# EasyEDA Pro project board-a24-color.eprj

# Schematic sample_board
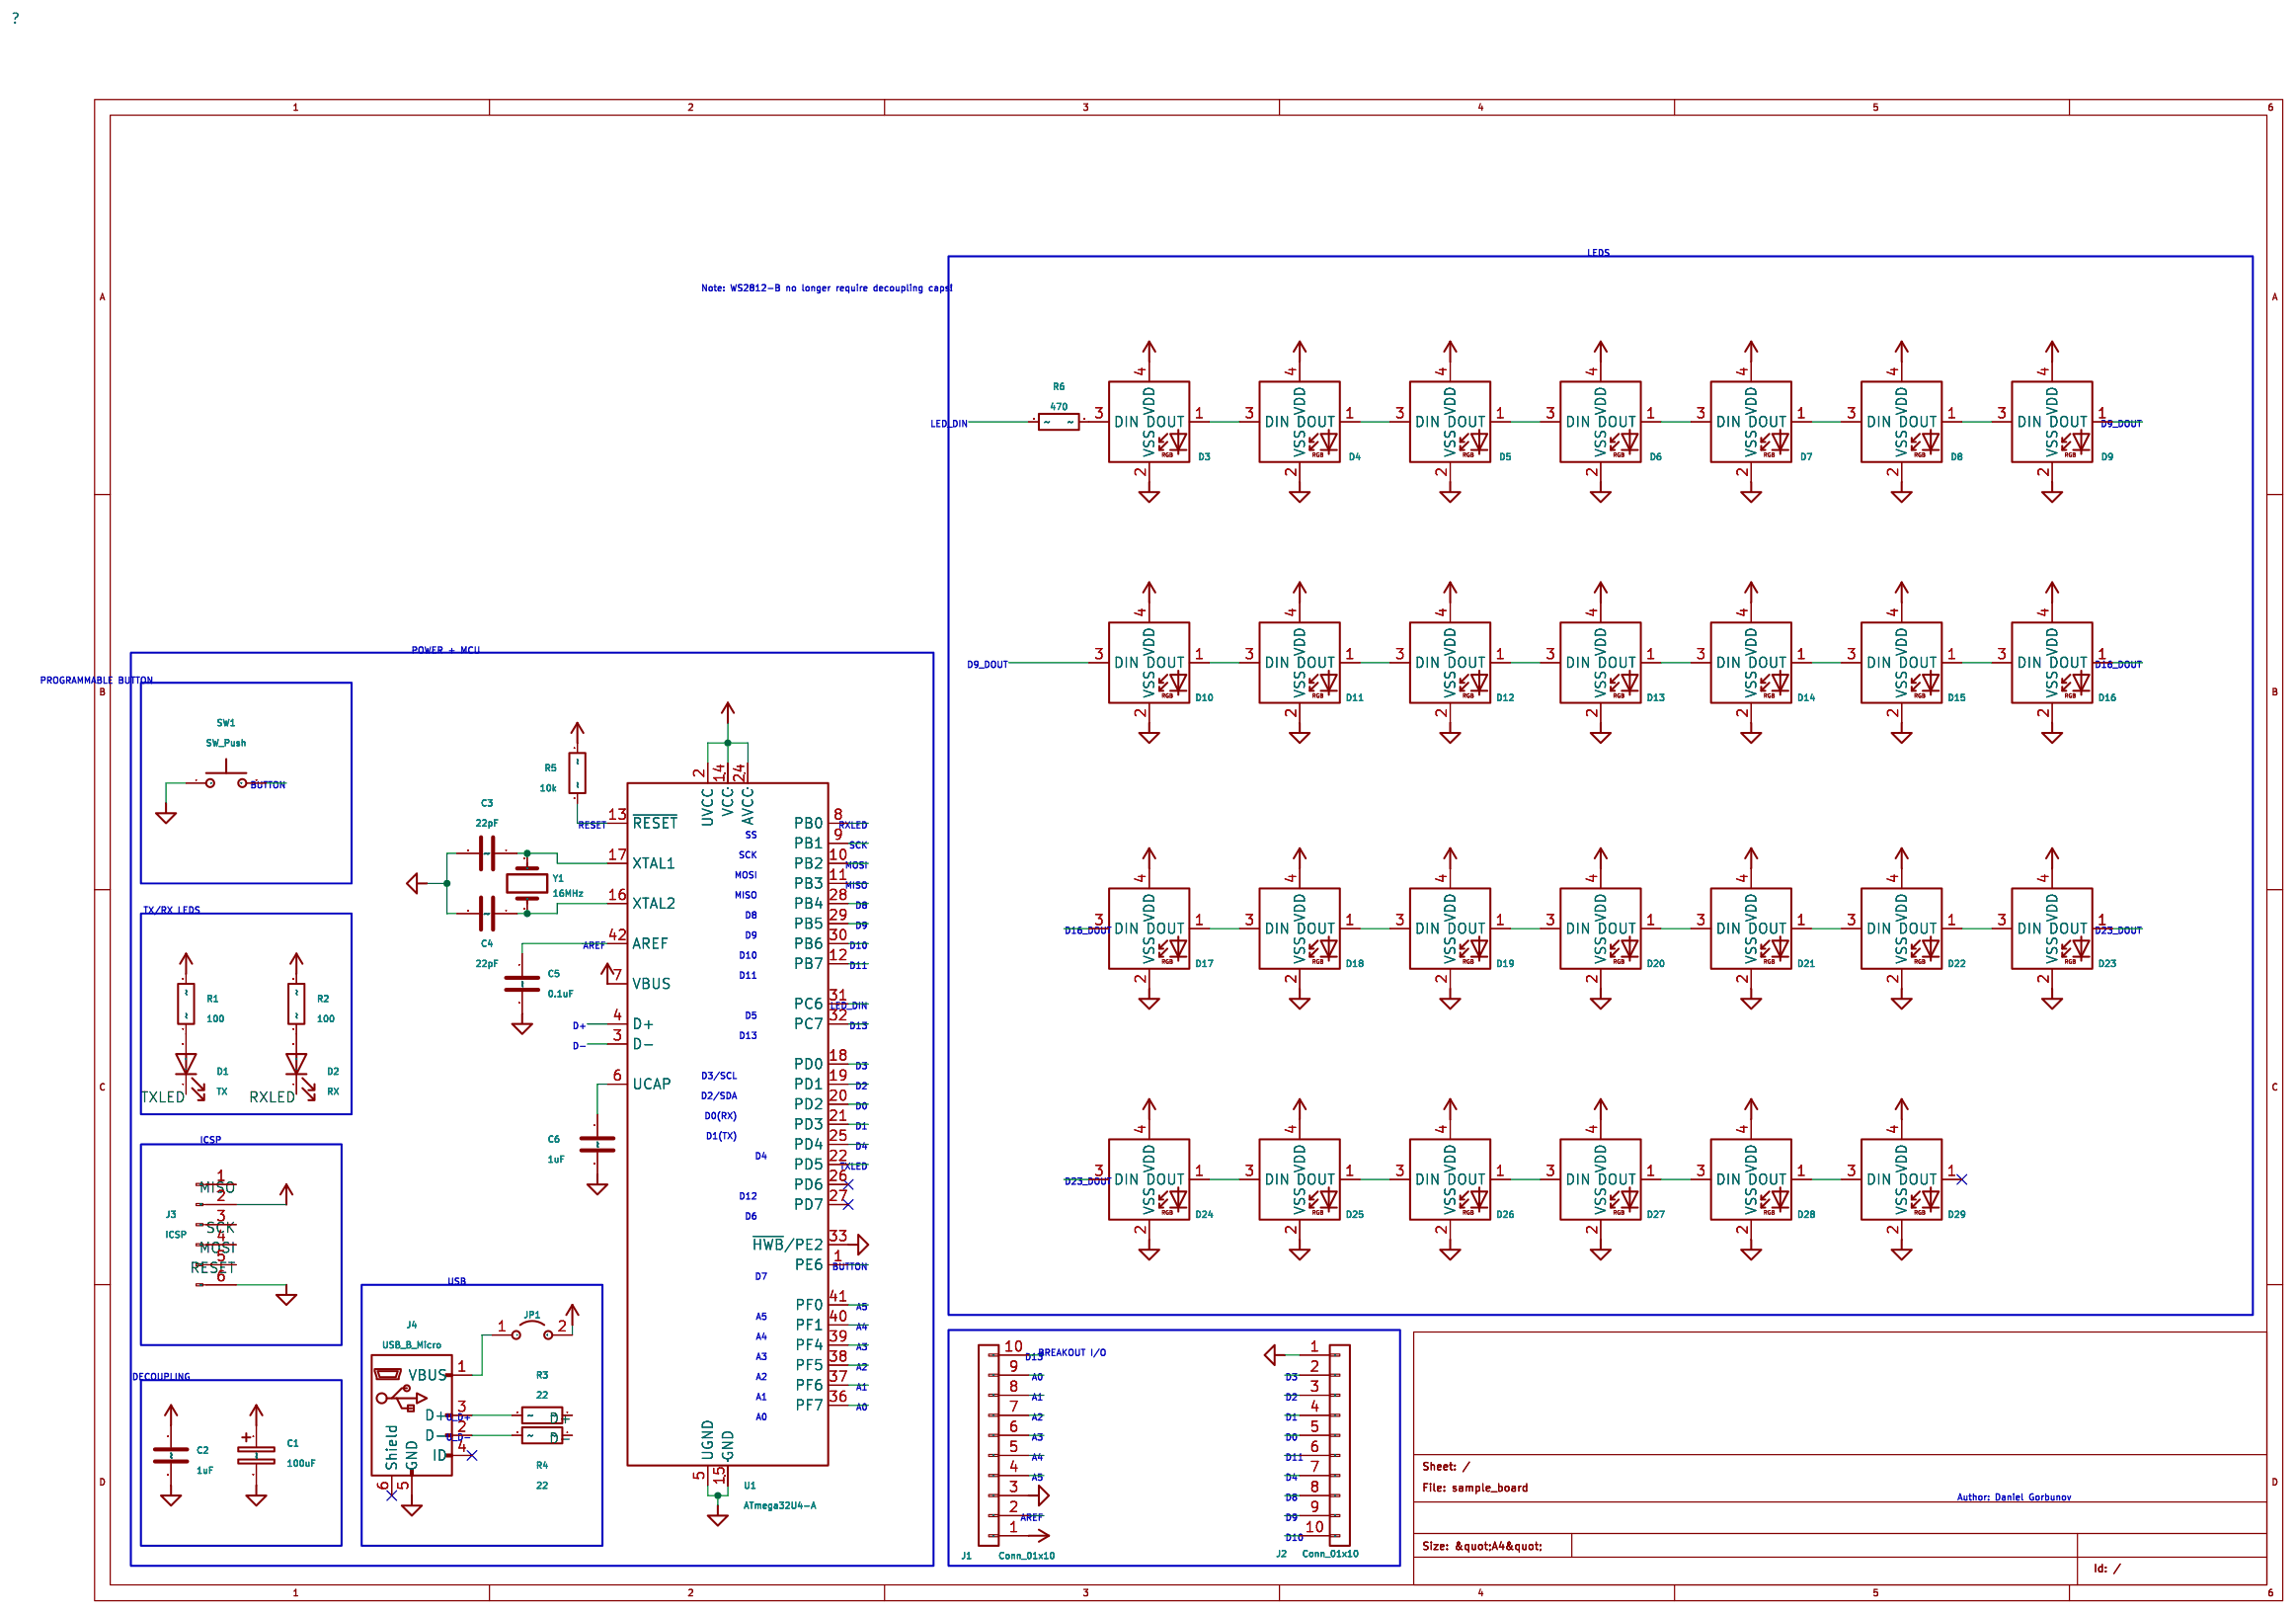
[diagram p0: schematic sheet]

## Parts
C1  100uF  [Capacitor_SMD:CP_Elec_5x5.3]
C2  1uF  [Capacitor_SMD:C_0805_2012Metric_Pad1.18x1.45mm_HandSolder]
C3  22pF  [Capacitor_SMD:C_0805_2012Metric_Pad1.18x1.45mm_HandSolder]
C4  22pF  [Capacitor_SMD:C_0805_2012Metric_Pad1.18x1.45mm_HandSolder]
C5  0.1uF  [Capacitor_SMD:C_0805_2012Metric_Pad1.18x1.45mm_HandSolder]
C6  1uF  [Capacitor_SMD:C_0805_2012Metric_Pad1.18x1.45mm_HandSolder]
D1  TX  [LED_SMD:LED_0805_2012Metric_Pad1.15x1.40mm_HandSolder]
D2  RX  [LED_SMD:LED_0805_2012Metric_Pad1.15x1.40mm_HandSolder]
D3  SK6812MINI  [LED_SMD:LED_SK6812MINI_PLCC4_3.5x3.5mm_P1.75mm]
D4  SK6812MINI  [LED_SMD:LED_SK6812MINI_PLCC4_3.5x3.5mm_P1.75mm]
D5  SK6812MINI  [LED_SMD:LED_SK6812MINI_PLCC4_3.5x3.5mm_P1.75mm]
D6  SK6812MINI  [LED_SMD:LED_SK6812MINI_PLCC4_3.5x3.5mm_P1.75mm]
D7  SK6812MINI  [LED_SMD:LED_SK6812MINI_PLCC4_3.5x3.5mm_P1.75mm]
D8  SK6812MINI  [LED_SMD:LED_SK6812MINI_PLCC4_3.5x3.5mm_P1.75mm]
D9  SK6812MINI  [LED_SMD:LED_SK6812MINI_PLCC4_3.5x3.5mm_P1.75mm]
D10  SK6812MINI  [LED_SMD:LED_SK6812MINI_PLCC4_3.5x3.5mm_P1.75mm]
D11  SK6812MINI  [LED_SMD:LED_SK6812MINI_PLCC4_3.5x3.5mm_P1.75mm]
D12  SK6812MINI  [LED_SMD:LED_SK6812MINI_PLCC4_3.5x3.5mm_P1.75mm]
D13  SK6812MINI  [LED_SMD:LED_SK6812MINI_PLCC4_3.5x3.5mm_P1.75mm]
D14  SK6812MINI  [LED_SMD:LED_SK6812MINI_PLCC4_3.5x3.5mm_P1.75mm]
D15  SK6812MINI  [LED_SMD:LED_SK6812MINI_PLCC4_3.5x3.5mm_P1.75mm]
D16  SK6812MINI  [LED_SMD:LED_SK6812MINI_PLCC4_3.5x3.5mm_P1.75mm]
D17  SK6812MINI  [LED_SMD:LED_SK6812MINI_PLCC4_3.5x3.5mm_P1.75mm]
D18  SK6812MINI  [LED_SMD:LED_SK6812MINI_PLCC4_3.5x3.5mm_P1.75mm]
D19  SK6812MINI  [LED_SMD:LED_SK6812MINI_PLCC4_3.5x3.5mm_P1.75mm]
D20  SK6812MINI  [LED_SMD:LED_SK6812MINI_PLCC4_3.5x3.5mm_P1.75mm]
D21  SK6812MINI  [LED_SMD:LED_SK6812MINI_PLCC4_3.5x3.5mm_P1.75mm]
D22  SK6812MINI  [LED_SMD:LED_SK6812MINI_PLCC4_3.5x3.5mm_P1.75mm]
D23  SK6812MINI  [LED_SMD:LED_SK6812MINI_PLCC4_3.5x3.5mm_P1.75mm]
D24  SK6812MINI  [LED_SMD:LED_SK6812MINI_PLCC4_3.5x3.5mm_P1.75mm]
D25  SK6812MINI  [LED_SMD:LED_SK6812MINI_PLCC4_3.5x3.5mm_P1.75mm]
D26  SK6812MINI  [LED_SMD:LED_SK6812MINI_PLCC4_3.5x3.5mm_P1.75mm]
D27  SK6812MINI  [LED_SMD:LED_SK6812MINI_PLCC4_3.5x3.5mm_P1.75mm]
D28  SK6812MINI  [LED_SMD:LED_SK6812MINI_PLCC4_3.5x3.5mm_P1.75mm]
D29  SK6812MINI  [LED_SMD:LED_SK6812MINI_PLCC4_3.5x3.5mm_P1.75mm]
J1  Conn_01x10  [Connector_PinHeader_2.54mm:PinHeader_1x10_P2.54mm_Vertical]
J2  Conn_01x10  [Connector_PinHeader_2.54mm:PinHeader_1x10_P2.54mm_Vertical]
J3  ICSP  [Connector_PinHeader_2.54mm:PinHeader_2x03_P2.54mm_Vertical]
J4  USB_B_Micro  [Connector_USB:USB_Micro-B_GCT_USB3076-30-A]
JP1  Jumper_2_Open  [Jumper:SolderJumper-2_P1.3mm_Open_TrianglePad1.0x1.5mm]
R1  100  [Resistor_SMD:R_0805_2012Metric_Pad1.20x1.40mm_HandSolder]
R2  100  [Resistor_SMD:R_0805_2012Metric_Pad1.20x1.40mm_HandSolder]
R3  22  [Resistor_SMD:R_0805_2012Metric_Pad1.20x1.40mm_HandSolder]
R4  22  [Resistor_SMD:R_0805_2012Metric_Pad1.20x1.40mm_HandSolder]
R5  10k  [Resistor_SMD:R_0805_2012Metric_Pad1.20x1.40mm_HandSolder]
R6  470  [Resistor_SMD:R_0805_2012Metric_Pad1.20x1.40mm_HandSolder]
SW1  SW_Push  [Button_Switch_SMD:SW_SPST_PTS647_Sx38]
U1  ATmega32U4-A  [Package_QFP:TQFP-44_10x10mm_P0.8mm]
Y1  16MHz  [Crystal:Crystal_SMD_5032-2Pin_5.0x3.2mm]

## Library data of the parts
C1 = Device_C_Polarized
C2-C6 = Device_C
D1 D2 = Device_LED
D3-D29 = LED_SK6812MINI: User doc link: https://cdn-shop.adafruit.com/product-files/2686/SK6812MINI_REV.01-1-2.pdf
J1 J2 = Connector_Generic_Conn_01x10
J3 = Connector_Conn_01x06_Pin
J4 = Connector_USB_B_Micro
JP1 = Jumper_Jumper_2_Open
R1-R6 = Device_R
SW1 = Switch_SW_Push: Push button switch, generic, two pins
U1 = MCU_Microchip_ATmega_ATmega32U4-A: User doc link: http://ww1.microchip.com/downloads/en/DeviceDoc/Atmel-7766-8-bit-AVR-ATmega16U4-32U4_Datasheet.pdf
Y1 = Device_Crystal

## Nets
A0: J1.9(Pin) U1.36(PF7)
A1: J1.8(Pin) U1.37(PF6)
A2: J1.7(Pin) U1.38(PF5)
A3: J1.6(Pin) U1.39(PF4)
A4: J1.5(Pin) U1.40(PF1)
A5: J1.4(Pin) U1.41(PF0)
AREF: C5.1 J1.2(Pin) U1.42(AREF)
BUTTON: SW1.2 U1.1(PE6)
D0: J2.5(Pin) U1.20(PD2)
D1: J2.4(Pin) U1.21(PD3)
D2: J2.3(Pin) U1.19(PD1)
D3: J2.2(Pin) U1.18(PD0)
D4: J2.7(Pin) U1.25(PD4)
D8: J2.8(Pin) U1.28(PB4)
D9: J2.9(Pin) U1.29(PB5)
D9_DOUT: D9.1(DOUT) D10.3(DIN)
D10: J2.10(Pin) U1.30(PB6)
D11: J2.6(Pin) U1.12(PB7)
D13: J1.10(Pin) U1.32(PC7)
D16_DOUT: D16.1(DOUT) D17.3(DIN)
D23_DOUT: D23.1(DOUT) D24.3(DIN)
D+: R3.1 U1.4(D+)
D-: R4.1 U1.3(D-)
LED_DIN: R6.1 U1.31(PC6)
MISO: J3.1(Pin) U1.11(PB3)
MOSI: J3.4(Pin) U1.10(PB2)
POWER_+5V: C1.1 C2.1 D3.4(VDD) D4.4(VDD) D5.4(VDD) D6.4(VDD) D7.4(VDD) D8.4(VDD) D9.4(VDD) D10.4(VDD) D11.4(VDD) D12.4(VDD) D13.4(VDD) D14.4(VDD) D15.4(VDD) D16.4(VDD) D17.4(VDD) D18.4(VDD) D19.4(VDD) D20.4(VDD) D21.4(VDD) D22.4(VDD) D23.4(VDD) D24.4(VDD) D25.4(VDD) D26.4(VDD) D27.4(VDD) D28.4(VDD) D29.4(VDD) J1.1(Pin) J3.2(Pin) JP1.2(B) R1.2 R2.2 R5.1 U1.2(UVCC) U1.7(VBUS) U1.14(VCC) U1.24(AVCC) U1.34(VCC) U1.44(AVCC)
POWER_GND: C1.2 C2.2 C3.2 C4.2 C5.2 C6.2 D3.2(VSS) D4.2(VSS) D5.2(VSS) D6.2(VSS) D7.2(VSS) D8.2(VSS) D9.2(VSS) D10.2(VSS) D11.2(VSS) D12.2(VSS) D13.2(VSS) D14.2(VSS) D15.2(VSS) D16.2(VSS) D17.2(VSS) D18.2(VSS) D19.2(VSS) D20.2(VSS) D21.2(VSS) D22.2(VSS) D23.2(VSS) D24.2(VSS) D25.2(VSS) D26.2(VSS) D27.2(VSS) D28.2(VSS) D29.2(VSS) J1.3(Pin) J2.1(Pin) J3.6(Pin) J4.5(GND) SW1.1 U1.5(UGND) U1.15(GND) U1.23(GND) U1.33(~{HWB}/PE2) U1.35(GND) U1.43(GND)
RESET: J3.5(Pin) R5.2 U1.13(~{RESET})
RXLED: D2.1(K) U1.8(PB0)
SCK: J3.3(Pin) U1.9(PB1)
TXLED: D1.1(K) U1.22(PD5)
U_D+: J4.3(D+) R3.2
U_D-: J4.2(D-) R4.2
NET-(D1-A): D1.2(A) R1.1
NET-(D2-A): D2.2(A) R2.1
NET-(D3-DIN): D3.3(DIN) R6.2
NET-(D3-DOUT): D3.1(DOUT) D4.3(DIN)
NET-(D4-DOUT): D4.1(DOUT) D5.3(DIN)
NET-(D5-DOUT): D5.1(DOUT) D6.3(DIN)
NET-(D6-DOUT): D6.1(DOUT) D7.3(DIN)
NET-(D7-DOUT): D7.1(DOUT) D8.3(DIN)
NET-(D8-DOUT): D8.1(DOUT) D9.3(DIN)
NET-(D10-DOUT): D10.1(DOUT) D11.3(DIN)
NET-(D11-DOUT): D11.1(DOUT) D12.3(DIN)
NET-(D12-DOUT): D12.1(DOUT) D13.3(DIN)
NET-(D13-DOUT): D13.1(DOUT) D14.3(DIN)
NET-(D14-DOUT): D14.1(DOUT) D15.3(DIN)
NET-(D15-DOUT): D15.1(DOUT) D16.3(DIN)
NET-(D17-DOUT): D17.1(DOUT) D18.3(DIN)
NET-(D18-DOUT): D18.1(DOUT) D19.3(DIN)
NET-(D19-DOUT): D19.1(DOUT) D20.3(DIN)
NET-(D20-DOUT): D20.1(DOUT) D21.3(DIN)
NET-(D21-DOUT): D21.1(DOUT) D22.3(DIN)
NET-(D22-DOUT): D22.1(DOUT) D23.3(DIN)
NET-(D24-DOUT): D24.1(DOUT) D25.3(DIN)
NET-(D25-DOUT): D25.1(DOUT) D26.3(DIN)
NET-(D26-DOUT): D26.1(DOUT) D27.3(DIN)
NET-(D27-DOUT): D27.1(DOUT) D28.3(DIN)
NET-(D28-DOUT): D28.1(DOUT) D29.3(DIN)
NET-(J4-VBUS): J4.1(VBUS) JP1.1(A)
NET-(U1-UCAP): C6.1 U1.6(UCAP)
NET-(U1-XTAL1): C3.1 U1.17(XTAL1) Y1.1
NET-(U1-XTAL2): C4.1 U1.16(XTAL2) Y1.2

Not connected (* = marked no-connect by the designer): D29 1(DOUT)*; J4 4(ID)* 6(Shield)*; U1 26(PD6)* 27(PD7)*

## Notes on the sheet
- LEDS
- Note: WS2812-B no longer require decoupling caps!
- POWER + MCU
- PROGRAMMABLE BUTTON
- SS
- SCK
- MISO
- MOSI
- TX/RX LEDS
- D8
- D9
- D10
- D11
- D13
- D5
- D3/SCL
- D2/SDA
- D0(RX)
- ICSP
- D1(TX)
- D4
- D12
- D6
- USB
- D7
- A5
- A4
- A3
- BREAKOUT I/O
- DECOUPLING
- A2
- A0
- A1
- Author: Daniel Gorbunov

# Board sample_board
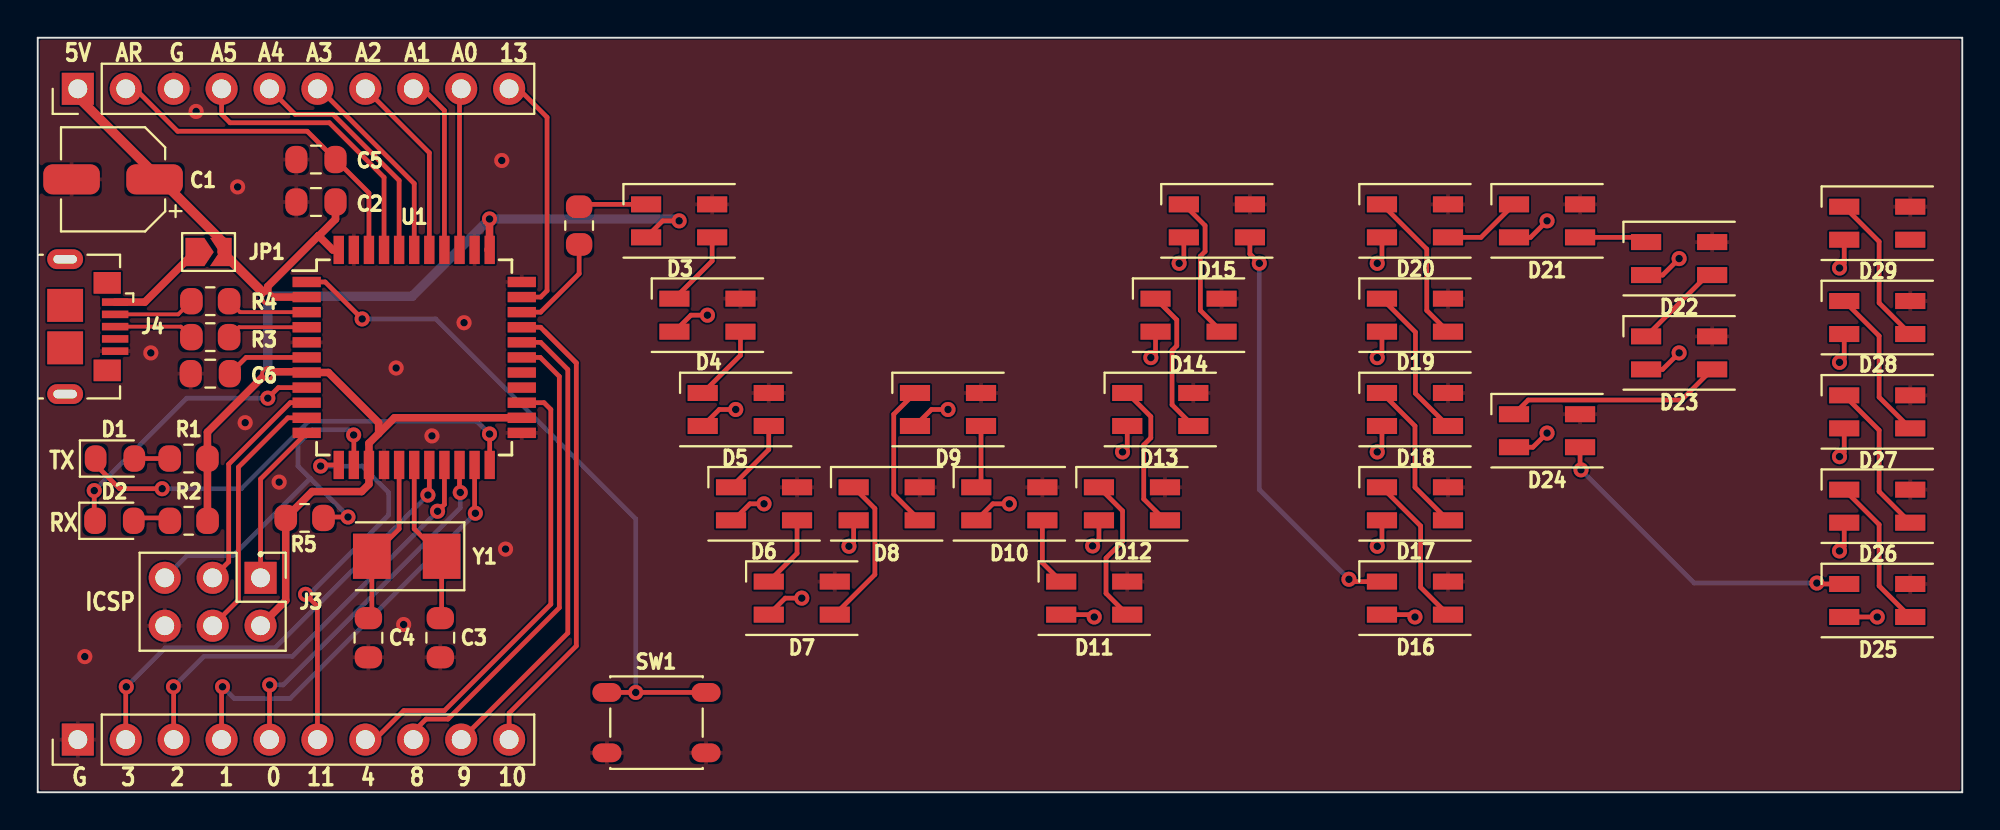
[diagram p1: board, top side]
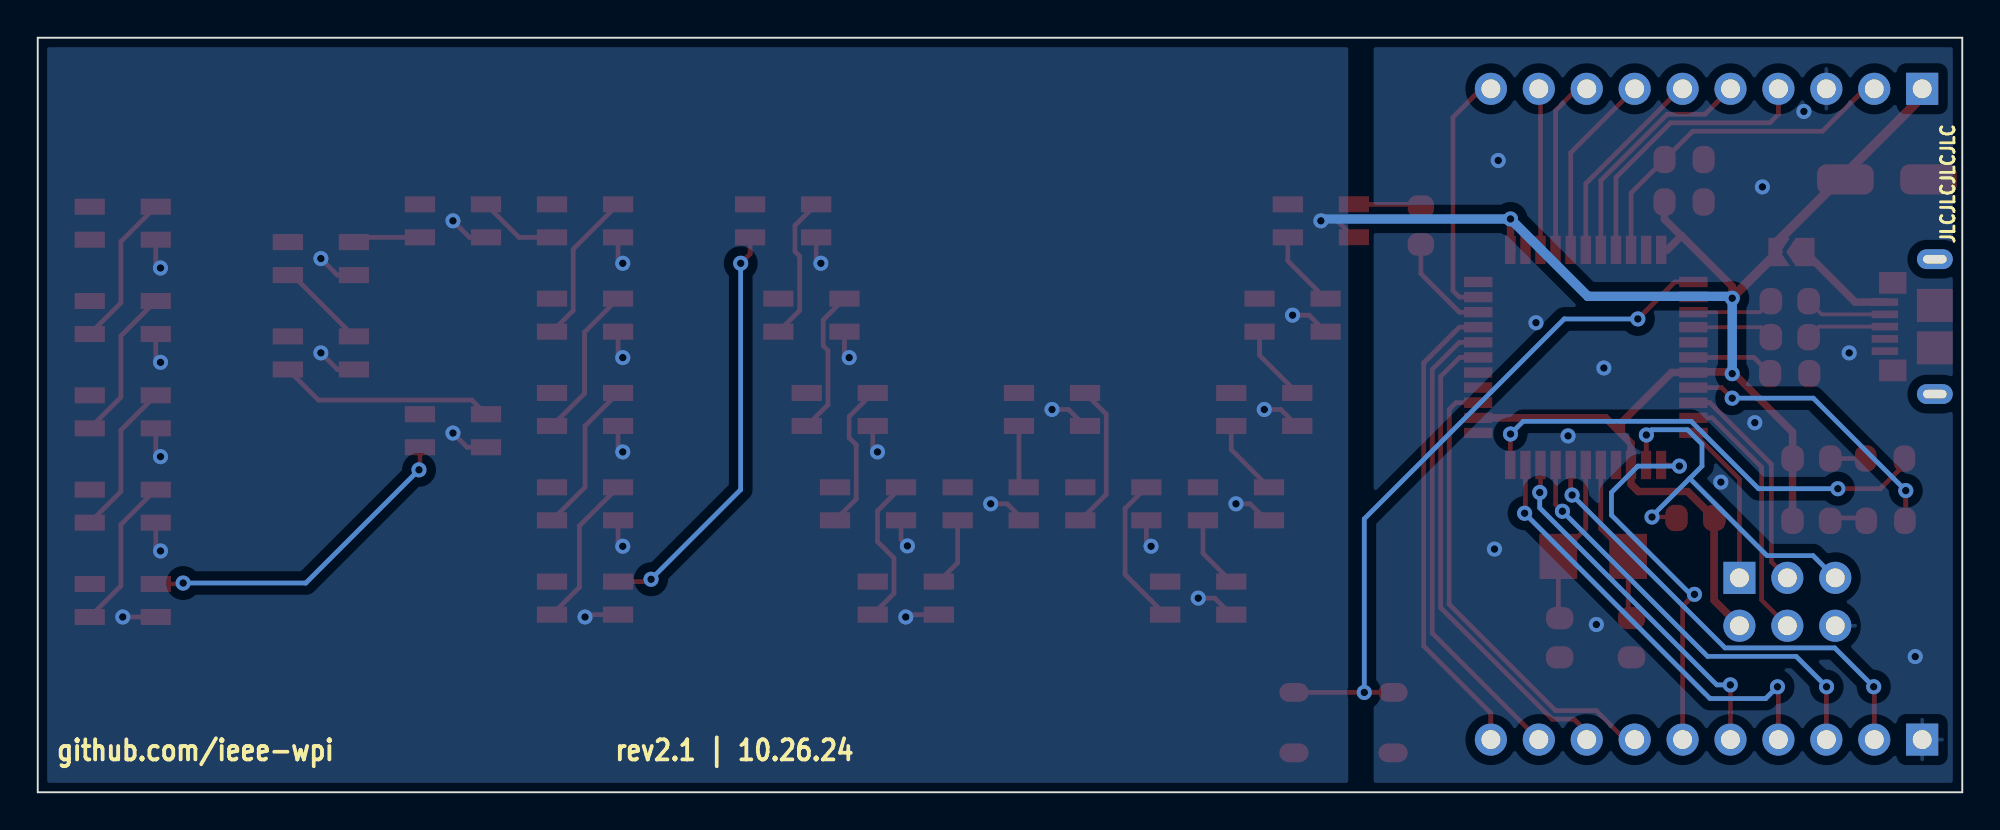
[diagram p2: board, bottom side, seen from below]

Outline 102 x 40 mm; copper layers: Top Layer, Bottom Layer. Coordinates in mm from the lower left corner of the outline.
Outline path: 0,40 102,40 102,0 0,0 0,40
Stack: Top Layer 0.0009mm / dielectric 1 0.0384mm FR4 er 4.5 / Bottom Layer 0.0009mm

## Design rules (mm)
spacing safeClearance (default): track to track 0.127, other pairs 0.127 to 0.2
track width trackWidth (default): min 0.127, default 0.254, max 2.54
differential pair differentialPair (default): width min 0.127, default 0.254, max 2.54; gap min 0.152, default 0.152
via viaSize (default): diameter min 0.5, default 0.61, max 10; hole min 0.3, default 0.305, max 6
net +5V uses CopperRegion1
pour ie950 uses CopperRegion2
pour ie951 uses CopperRegion1

## Placement (name value [footprint] x y rotation side)
C1  100uF  [Capacitor_SMD:CP_Elec_5x5.3]  3.99 32.49 180 top
C2  1uF  [Capacitor_SMD:C_0805_2012Metric_Pad1.18x1.45mm_HandSolder]  14.74 31.29 180 top
C3  22pF  [Capacitor_SMD:C_0805_2012Metric_Pad1.18x1.45mm_HandSolder]  21.34 8.19 270 top
C4  22pF  [Capacitor_SMD:C_0805_2012Metric_Pad1.18x1.45mm_HandSolder]  17.53 8.19 270 top
C5  0.1uF  [Capacitor_SMD:C_0805_2012Metric_Pad1.18x1.45mm_HandSolder]  14.74 33.54 180 top
C6  1uF  [Capacitor_SMD:C_0805_2012Metric_Pad1.18x1.45mm_HandSolder]  9.14 22.19 180 top
D1  TX  [LED_SMD:LED_0805_2012Metric_Pad1.15x1.40mm_HandSolder]  4.09 17.69 0 top
D2  RX  [LED_SMD:LED_0805_2012Metric_Pad1.15x1.40mm_HandSolder]  4.06 14.39 0 top
D3  SK6812MINI  [LED_SMD:LED_SK6812MINI_PLCC4_3.5x3.5mm_P1.75mm]  33.99 30.29 180 top
D4  SK6812MINI  [LED_SMD:LED_SK6812MINI_PLCC4_3.5x3.5mm_P1.75mm]  35.49 25.29 180 top
D5  SK6812MINI  [LED_SMD:LED_SK6812MINI_PLCC4_3.5x3.5mm_P1.75mm]  36.99 20.29 180 top
D6  SK6812MINI  [LED_SMD:LED_SK6812MINI_PLCC4_3.5x3.5mm_P1.75mm]  38.49 15.29 180 top
D7  SK6812MINI  [LED_SMD:LED_SK6812MINI_PLCC4_3.5x3.5mm_P1.75mm]  40.49 10.29 180 top
D8  SK6812MINI  [LED_SMD:LED_SK6812MINI_PLCC4_3.5x3.5mm_P1.75mm]  44.99 15.29 180 top
D9  SK6812MINI  [LED_SMD:LED_SK6812MINI_PLCC4_3.5x3.5mm_P1.75mm]  48.24 20.29 180 top
D10  SK6812MINI  [LED_SMD:LED_SK6812MINI_PLCC4_3.5x3.5mm_P1.75mm]  51.49 15.29 180 top
D11  SK6812MINI  [LED_SMD:LED_SK6812MINI_PLCC4_3.5x3.5mm_P1.75mm]  55.99 10.29 180 top
D12  SK6812MINI  [LED_SMD:LED_SK6812MINI_PLCC4_3.5x3.5mm_P1.75mm]  57.99 15.29 180 top
D13  SK6812MINI  [LED_SMD:LED_SK6812MINI_PLCC4_3.5x3.5mm_P1.75mm]  59.49 20.29 180 top
D14  SK6812MINI  [LED_SMD:LED_SK6812MINI_PLCC4_3.5x3.5mm_P1.75mm]  60.99 25.29 180 top
D15  SK6812MINI  [LED_SMD:LED_SK6812MINI_PLCC4_3.5x3.5mm_P1.75mm]  62.49 30.29 180 top
D16  SK6812MINI  [LED_SMD:LED_SK6812MINI_PLCC4_3.5x3.5mm_P1.75mm]  72.99 10.29 180 top
D17  SK6812MINI  [LED_SMD:LED_SK6812MINI_PLCC4_3.5x3.5mm_P1.75mm]  72.99 15.29 180 top
D18  SK6812MINI  [LED_SMD:LED_SK6812MINI_PLCC4_3.5x3.5mm_P1.75mm]  72.99 20.29 180 top
D19  SK6812MINI  [LED_SMD:LED_SK6812MINI_PLCC4_3.5x3.5mm_P1.75mm]  72.99 25.29 180 top
D20  SK6812MINI  [LED_SMD:LED_SK6812MINI_PLCC4_3.5x3.5mm_P1.75mm]  72.99 30.29 180 top
D21  SK6812MINI  [LED_SMD:LED_SK6812MINI_PLCC4_3.5x3.5mm_P1.75mm]  79.99 30.29 180 top
D22  SK6812MINI  [LED_SMD:LED_SK6812MINI_PLCC4_3.5x3.5mm_P1.75mm]  86.99 28.29 180 top
D23  SK6812MINI  [LED_SMD:LED_SK6812MINI_PLCC4_3.5x3.5mm_P1.75mm]  86.99 23.29 180 top
D24  SK6812MINI  [LED_SMD:LED_SK6812MINI_PLCC4_3.5x3.5mm_P1.75mm]  79.99 19.17 180 top
D25  SK6812MINI  [LED_SMD:LED_SK6812MINI_PLCC4_3.5x3.5mm_P1.75mm]  97.49 10.17 180 top
D26  SK6812MINI  [LED_SMD:LED_SK6812MINI_PLCC4_3.5x3.5mm_P1.75mm]  97.49 15.17 180 top
D27  SK6812MINI  [LED_SMD:LED_SK6812MINI_PLCC4_3.5x3.5mm_P1.75mm]  97.49 20.17 180 top
D28  SK6812MINI  [LED_SMD:LED_SK6812MINI_PLCC4_3.5x3.5mm_P1.75mm]  97.49 25.17 180 top
D29  SK6812MINI  [LED_SMD:LED_SK6812MINI_PLCC4_3.5x3.5mm_P1.75mm]  97.49 30.17 180 top
J1  Conn_01x10  [Connector_PinHeader_2.54mm:PinHeader_1x10_P2.54mm_Vertical]  2.12 37.29 90 top
J2  Conn_01x10  [Connector_PinHeader_2.54mm:PinHeader_1x10_P2.54mm_Vertical]  2.12 2.79 90 top
J3  ICSP  [Connector_PinHeader_2.54mm:PinHeader_2x03_P2.54mm_Vertical]  11.81 11.37 270 top
J4  USB_B_Micro  [Connector_USB:USB_Micro-B_GCT_USB3076-30-A]  2.65 24.69 270 top
JP1  Jumper_2_Open  [Jumper:SolderJumper-2_P1.3mm_Open_TrianglePad1.0x1.5mm]  9.05 28.64 0 top
R1  100  [Resistor_SMD:R_0805_2012Metric_Pad1.20x1.40mm_HandSolder]  7.99 17.69 0 top
R2  100  [Resistor_SMD:R_0805_2012Metric_Pad1.20x1.40mm_HandSolder]  8 14.39 0 top
R3  22  [Resistor_SMD:R_0805_2012Metric_Pad1.20x1.40mm_HandSolder]  9.14 24.13 180 top
R4  22  [Resistor_SMD:R_0805_2012Metric_Pad1.20x1.40mm_HandSolder]  9.14 26.03 180 top
R5  10k  [Resistor_SMD:R_0805_2012Metric_Pad1.20x1.40mm_HandSolder]  14.14 14.54 0 top
R6  470  [Resistor_SMD:R_0805_2012Metric_Pad1.20x1.40mm_HandSolder]  28.69 30.04 90 top
SW1  SW_Push  [Button_Switch_SMD:SW_SPST_PTS647_Sx38]  32.79 3.69 180 top
U1  ATmega32U4-A  [Package_QFP:TQFP-44_10x10mm_P0.8mm]  19.95 23.05 0 top
Y1  16MHz  [Crystal:Crystal_SMD_5032-2Pin_5.0x3.2mm]  19.56 12.51 180 top

## Footprints (pads in the part's own frame, mm; a bottom-side part is the same pattern mirrored in y, then rotated)
Button_Switch_SMD:SW_SPST_PTS647_Sx38
  rrect 1.55x1 smd: 1(-2.625,1.6) 1(2.625,1.6) 2(-2.625,-1.6) 2(2.625,-1.6)
Capacitor_SMD:C_0805_2012Metric_Pad1.18x1.45mm_HandSolder
  rrect 1.175x1.45 smd: 1(-1.038,0) 2(1.038,0)
Capacitor_SMD:CP_Elec_5x5.3
  rrect 3x1.6 smd: 1(-2.2,0) 2(2.2,0)
Connector_PinHeader_2.54mm:PinHeader_1x10_P2.54mm_Vertical
  rect 1.7x1.7 hole 1: 1(0,0)
  round 1.7 hole 1: 2(0,-2.54) 3(0,-5.08) 4(0,-7.62) 5(0,-10.16) 6(0,-12.7) 7(0,-15.24) 8(0,-17.78) 9(0,-20.32) 10(0,-22.86)
Connector_PinHeader_2.54mm:PinHeader_2x03_P2.54mm_Vertical
  rect 1.7x1.7 hole 1: 1(0,0)
  round 1.7 hole 1: 2(2.54,0) 3(0,-2.54) 4(2.54,-2.54) 5(0,-5.08) 6(2.54,-5.08)
Connector_USB:USB_Micro-B_GCT_USB3076-30-A
  rect 0.4x1.4 smd: 1(-1.3,1.45) 2(-0.65,1.45) 3(0,1.45) 4(0.65,1.45) 5(1.3,1.45)
  oval 1.05x1.9 hole 0.45x1.25: 6(-3.575,-1.2) 6(3.575,-1.2)
  rect 1.15x1.45 smd: 6(-2.32,1.03) 6(2.32,1.03)
  rect 1.75x1.9 smd: 6(-1.125,-1.2) 6(1.125,-1.2)
Crystal:Crystal_SMD_5032-2Pin_5.0x3.2mm
  rect 2x2.4 smd: 1(-1.85,0) 2(1.85,0)
Jumper:SolderJumper-2_P1.3mm_Open_TrianglePad1.0x1.5mm
  custom 1.5x1.5 smd: 1(-0.725,0)
  custom 1.15x1.5 smd: 2(0.725,0)
LED_SMD:LED_0805_2012Metric_Pad1.15x1.40mm_HandSolder
  rrect 1.15x1.4 smd: 1(-1.025,0) 2(1.025,0)
LED_SMD:LED_SK6812MINI_PLCC4_3.5x3.5mm_P1.75mm
  rect 1.6x0.85 smd: 1(-1.75,0.875) 2(-1.75,-0.875) 3(1.75,-0.875) 4(1.75,0.875)
Package_QFP:TQFP-44_10x10mm_P0.8mm
  rect 1.5x0.55 smd: 1(-5.7,4) 2(-5.7,3.2) 3(-5.7,2.4) 4(-5.7,1.6) 5(-5.7,0.8) 6(-5.7,0) 7(-5.7,-0.8) 8(-5.7,-1.6) 9(-5.7,-2.4) 10(-5.7,-3.2) 11(-5.7,-4) 23(5.7,-4) 24(5.7,-3.2) 25(5.7,-2.4) 26(5.7,-1.6) 27(5.7,-0.8) 28(5.7,0) 29(5.7,0.8) 30(5.7,1.6) 31(5.7,2.4) 32(5.7,3.2) 33(5.7,4)
  rect 0.55x1.5 smd: 12(-4,-5.7) 13(-3.2,-5.7) 14(-2.4,-5.7) 15(-1.6,-5.7) 16(-0.8,-5.7) 17(0,-5.7) 18(0.8,-5.7) 19(1.6,-5.7) 20(2.4,-5.7) 21(3.2,-5.7) 22(4,-5.7) 34(4,5.7) 35(3.2,5.7) 36(2.4,5.7) 37(1.6,5.7) 38(0.8,5.7) 39(0,5.7) 40(-0.8,5.7) 41(-1.6,5.7) 42(-2.4,5.7) 43(-3.2,5.7) 44(-4,5.7)
Resistor_SMD:R_0805_2012Metric_Pad1.20x1.40mm_HandSolder
  rrect 1.2x1.4 smd: 1(-1,0) 2(1,0)

## Nets
+5V: C1.1 C2.1 D3.4 D4.4 D5.4 D6.4 D7.4 D8.4 D9.4 D10.4 D11.4 D12.4 D13.4 D14.4 D15.4 D16.4 D17.4 D18.4 D19.4 D20.4 D21.4 D22.4 D23.4 D24.4 D25.4 D26.4 D27.4 D28.4 D29.4 J1.1 J3.2 JP1.2 R1.2 R2.2 R5.1 U1.2 U1.7 U1.14 U1.24 U1.34 U1.44
GND: C1.2 C2.2 C3.2 C4.2 C5.2 C6.2 D3.2 D4.2 D5.2 D6.2 D7.2 D8.2 D9.2 D10.2 D11.2 D12.2 D13.2 D14.2 D15.2 D16.2 D17.2 D18.2 D19.2 D20.2 D21.2 D22.2 D23.2 D24.2 D25.2 D26.2 D27.2 D28.2 D29.2 J1.3 J2.1 J3.6 J4.5 SW1.1 U1.5 U1.15 U1.23 U1.33 U1.35 U1.43
/A0: J1.9 U1.36
/A1: J1.8 U1.37
/A2: J1.7 U1.38
/A3: J1.6 U1.39
/A4: J1.5 U1.40
/A5: J1.4 U1.41
/AREF: C5.1 J1.2 U1.42
/BUTTON: SW1.2 U1.1
/D0: J2.5 U1.20
/D1: J2.4 U1.21
/D2: J2.3 U1.19
/D3: J2.2 U1.18
/D4: J2.7 U1.25
/D8: J2.8 U1.28
/D9: J2.9 U1.29
/D9_DOUT: D9.1 D10.3
/D10: J2.10 U1.30
/D11: J2.6 U1.12
/D13: J1.10 U1.32
/D16_DOUT: D16.1 D17.3
/D23_DOUT: D23.1 D24.3
/D+: R3.1 U1.4
/D-: R4.1 U1.3
/LED_DIN: R6.1 U1.31
/MISO: J3.1 U1.11
/MOSI: J3.4 U1.10
/RESET: J3.5 R5.2 U1.13
/RXLED: D2.1 U1.8
/SCK: J3.3 U1.9
/TXLED: D1.1 U1.22
/U_D+: J4.3 R3.2
/U_D-: J4.2 R4.2
NET-(D1-A): D1.2 R1.1
NET-(D2-A): D2.2 R2.1
NET-(D3-DIN): D3.3 R6.2
NET-(D3-DOUT): D3.1 D4.3
NET-(D4-DOUT): D4.1 D5.3
NET-(D5-DOUT): D5.1 D6.3
NET-(D6-DOUT): D6.1 D7.3
NET-(D7-DOUT): D7.1 D8.3
NET-(D8-DOUT): D8.1 D9.3
NET-(D10-DOUT): D10.1 D11.3
NET-(D11-DOUT): D11.1 D12.3
NET-(D12-DOUT): D12.1 D13.3
NET-(D13-DOUT): D13.1 D14.3
NET-(D14-DOUT): D14.1 D15.3
NET-(D15-DOUT): D15.1 D16.3
NET-(D17-DOUT): D17.1 D18.3
NET-(D18-DOUT): D18.1 D19.3
NET-(D19-DOUT): D19.1 D20.3
NET-(D20-DOUT): D20.1 D21.3
NET-(D21-DOUT): D21.1 D22.3
NET-(D22-DOUT): D22.1 D23.3
NET-(D24-DOUT): D24.1 D25.3
NET-(D25-DOUT): D25.1 D26.3
NET-(D26-DOUT): D26.1 D27.3
NET-(D27-DOUT): D27.1 D28.3
NET-(D28-DOUT): D28.1 D29.3
NET-(J4-VBUS): J4.1 JP1.1
NET-(U1-UCAP): C6.1 U1.6
NET-(U1-XTAL1): C3.1 U1.17 Y1.1
NET-(U1-XTAL2): C4.1 U1.16 Y1.2
UNCONNECTED-(D29-DOUT-PAD1): D29.1
UNCONNECTED-(J4-ID-PAD4): J4.4
UNCONNECTED-(J4-SHIELD-PAD6): J4.6
UNCONNECTED-(U1-PD6-PAD26): U1.26
UNCONNECTED-(U1-PD7-PAD27): U1.27

## Via types
v1: diameter 0.8, hole 0.4, Top Layer to Bottom Layer, 64 vias

## Routing (per net, layer and track width the routed paths; a pad name or vN(x,y) marks a point on that pad's centre or on a via; arc(x,y) is an arc through that point)
+5V: length 142.6
  Top Layer w0.25: D24.4 79.24,18.29 v1(79.99,19.04) ; D15.4 60.74,28.29 v1(60.49,28.04) ; D17.4 71.24,13.29 v1(70.99,13.04) ; v1(95.49,12.79) 95.74,13.04 D26.4 ; v1(38.49,15.29) 37.74,15.29 36.87,14.42 D6.4 ; D5.4 36.12,20.29 v1(36.99,20.29) ; v1(35.49,25.29) 34.62,25.29 D4.4 ; v1(95.49,27.79) 95.74,28.04 D29.4 ; v1(86.99,23.29) 86.12,22.42 D23.4 ; v1(58.99,23.04) 59.24,23.29 D14.4 ; D19.4 71.24,23.29 v1(70.99,23.04) ; D27.4 95.74,18.04 v1(95.49,17.79) ; v1(95.49,22.79) 95.74,23.04 D28.4 ; D13.4 57.74,18.29 v1(57.49,18.04) ; v1(51.49,15.29) 50.62,15.29 D10.4 ; v1(42.99,13.04) 43.24,13.29 D8.4 ; v1(55.99,9.29) 55.87,9.42 D11.4 ; D20.4 71.24,28.29 v1(70.99,28.04) ; v1(48.24,20.29) 47.37,20.29 D9.4 ; D21.4 79.12,29.42 v1(79.99,30.29) ; D7.4 39.62,10.29 v1(40.49,10.29) ; D12.4 56.24,13.39 v1(55.91,13.06) ; v1(72.99,9.29) 72.87,9.42 D16.4 ; v1(33.99,30.29) 33.12,30.29 D3.4 ; D22.4 86.12,27.42 v1(86.99,28.29) ; v1(70.99,18.04) 71.24,18.29 D18.4 ; D25.4 v1(97.49,9.29) ; C2.1 15.95,31.12
  Top Layer w0.4: 18.07,19.02 18.07,19.59 15.4,22.25 U1.7 14.21,22.29 12.19,22.29 v1(12.19,22.19) 12.09,22.19 8.99,19.09 8.99,14.55 9,14.54 ; 18.07,19.02 18.9,19.85 U1.24 ; 18.07,19.02 17.55,18.5 U1.14 17.55,16.33 17.17,15.94 14.54,15.94 R5.1 13.14,10.16 J3.2 ; 12.19,26.29 12.19,26.82 14.88,29.5 ; 12.19,26.29 12.17,26.25 12.23,26.19 v1(12.19,26.19) 12.19,26.22 ; 12.19,26.29 12.23,26.25 U1.2 ; v1(23.94,30.39) 23.94,28.76 U1.34 23.86,28.75 ; C2.1 15.78,30.38 14.91,29.5 14.88,29.5 ; 14.88,29.5 15.63,28.75 U1.44
  Top Layer w0.5: 12.19,26.22 JP1.2 9.78,29.21 2.12,36.86 2.12,37.79
  Bottom Layer w0.4: 33.89,30.39 v1(33.99,30.29)
  Bottom Layer w0.5: 33.89,30.39 v1(23.94,30.39) 19.84,26.29 12.19,26.29 ; v1(12.19,26.19) v1(12.19,22.19)
GND:
  vias: v1(2.49,7.19) v1(5.99,23.29) v1(8.39,36.09) v1(10.59,32.09) v1(10.99,19.59) v1(12.79,16.44) v1(18.99,22.49) v1(19.39,8.89) v1(20.89,18.89) v1(22.59,24.89) v1(24.59,33.49) v1(24.79,12.89)
/A0: length 9.1
  Top Layer w0.25: 22.44,37.79 22.35,37.7 U1.36
/A1: length 9.7
  Top Layer w0.25: 19.9,37.79 21.55,36.14 U1.37
/A2: length 9.9
  Top Layer w0.25: U1.38 20.75,33.9 J1.7
/A3: length 10.7
  Top Layer w0.25: U1.39 19.95,32.27 14.93,37.29 J1.6
/A4: length 12.6
  Top Layer w0.25: U1.40 19.15,32.43 15.64,35.94 13.63,35.94 J1.5
/A5: length 15.2
  Top Layer w0.25: U1.41 18.35,32.59 15.46,35.49 10.19,35.49 9.74,35.94 J1.4
/AREF: length 18.4
  Top Layer w0.25: 4.66,37.79 7.41,35.04 14.28,35.04 C5.1 17.55,31.77 U1.42
/BUTTON: length 37.1
  Top Layer w0.25: SW1.2 v1(31.69,5.29) SW1.2 ; v1(17.19,25.09) 15.23,27.05 U1.1
  Bottom Layer w0.25: v1(31.69,5.29) 31.69,14.49 21.09,25.09 v1(17.19,25.09)
/D0: length 19.4
  Top Layer w0.25: 22.35,15.95 22.35,15.93 v1(22.39,15.89) ; 22.35,15.95 22.39,15.99 v1(22.39,15.89) ; 22.35,15.95 U1.20 ; v1(12.29,5.69) 12.28,5.68 J2.5 ; v1(22.39,15.89) 22.29,15.89
  Bottom Layer w0.25: v1(12.29,5.69) 13.01,5.69 22.39,15.08 v1(22.39,15.89)
/D1: length 23.1
  Top Layer w0.25: v1(9.79,5.59) 9.74,5.54 J2.4 ; U1.21 23.15,14.83 v1(23.19,14.79)
  Bottom Layer w0.25: v1(23.19,14.79) 13.37,4.97 10.42,4.97 v1(9.79,5.59)
/D2: length 23.3
  Top Layer w0.25: J2.3 7.2,5.58 v1(7.19,5.59) ; U1.19 21.55,15.26 v1(21.19,14.9)
  Bottom Layer w0.25: v1(21.19,14.9) 13.5,7.2 8.81,7.2 v1(7.19,5.59)
/D3: length 24.7
  Top Layer w0.25: 20.75,15.8 20.71,15.76 v1(20.68,15.76) 20.75,15.83 U1.18 ; v1(4.69,5.59) 4.66,5.56 J2.2
  Bottom Layer w0.25: v1(4.69,5.59) 6.75,7.65 12.58,7.65 v1(20.68,15.76)
/D4: length 25
  Top Layer w0.25: U1.25 26.83,20.65 27.19,20.29 27.19,9.97 21.56,4.33 19.4,4.33 17.36,2.29
/D8: length 26.4
  Top Layer w0.25: U1.28 26.63,23.05 27.64,22.04 27.64,9.78 21.74,3.88 20.58,3.88 19.9,3.2 19.9,2.29 19.9,2.68
/D9: length 25
  Top Layer w0.25: J2.9 28.09,8.44 28.09,22.41 26.65,23.85 U1.29 ; 22.44,2.34 22.44,2.29
/D9_DOUT: length 3.4
  Top Layer w0.25: D10.3 49.99,16.42 D9.1
/D10: length 28
  Top Layer w0.25: 28.54,22.76 26.85,24.45 ; 28.54,22.76 26.65,24.65 U1.30 ; 28.54,22.76 28.54,7.76 24.98,4.2 24.98,2.29
/D11: length 21.1
  Top Layer w0.25: U1.12 15.25,17.35 v1(14.99,17.29) 15.19,17.29 ; v1(14.19,10.49) 14.82,9.86 14.82,2.29
  Bottom Layer w0.25: v1(14.99,17.29) 17.19,17.29 18.59,15.89 18.59,14.69 14.39,10.49 v1(14.19,10.49)
/D13: length 13.5
  Top Layer w0.25: 24.98,37.79 26.99,35.78 26.99,26.59 26.65,26.25 U1.32
/D16_DOUT: length 8.2
  Top Layer w0.25: D17.3 73.29,14.12 73.29,10.87 D16.1
/D23_DOUT: length 11.5
  Top Layer w0.25: D24.3 78.99,20.79 87.12,20.79 D23.1
/D+: length 4.3
  Top Layer w0.2: U1.4 10.67,24.65 R3.1
/D-: length 4.4
  Top Layer w0.2: R4.1 10.72,25.45 U1.3
/LED_DIN: length 5.4
  Top Layer w0.25: U1.31 26.65,25.45 28.69,27.49 R6.1
/MISO: length 8.7
  Top Layer w0.25: J3.1 11.81,16.61 U1.11
/MOSI: length 13.7
  Top Layer w0.25: J3.4 10.64,10.19 10.64,17.23 13.25,19.85 U1.10
/RESET: length 21.2
  Top Layer w0.25: U1.13 16.75,18.93 v1(16.74,18.94) ; v1(16.44,14.59) 15.19,14.59 R5.2
  Bottom Layer w0.25: 14.44,16.64 10.34,12.54 7.91,12.54 J3.5 ; 14.44,16.64 13.79,17.29 13.79,18.46 14.56,19.22 16.47,19.22 v1(16.74,18.94) ; 14.44,16.64 16.44,14.64 v1(16.44,14.59)
/RXLED: length 15
  Top Layer w0.25: U1.8 12.75,21.45 v1(12.19,20.89) ; v1(2.99,15.99) 2.99,14.59 3.04,14.54
  Bottom Layer w0.25: v1(2.99,15.99) 7.89,20.89 v1(12.19,20.89)
/SCK: length 11.9
  Top Layer w0.25: U1.9 13.38,20.65 10.12,17.39 10.12,12.22 J3.3
/TXLED: length 24.8
  Top Layer w0.25: 3.04,17.39 4.34,16.09 v1(6.59,16.09) ; U1.22 23.95,18.98 v1(23.94,18.99)
  Bottom Layer w0.25: v1(23.94,18.99) 23.27,19.67 14.37,19.67 10.79,16.09 v1(6.59,16.09)
/U_D+: length 4.3
  Top Layer w0.2: 4.1,24.69 7.59,24.69 R3.2
/U_D-: length 4.3
  Top Layer w0.2: 4.1,25.33 7.45,25.33 R4.2
NET-(D1-A): length 1.9
  Top Layer w0.25: D1.2 R1.1
NET-(D2-A): length 1.9
  Top Layer w0.25: 7,14.54 5.09,14.54
NET-(D3-DIN): length 3.6
  Top Layer w0.25: D3.3 28.82,31.17 R6.2
NET-(D3-DOUT): length 4.1
  Top Layer w0.25: D4.3 35.74,28.17 D3.1
NET-(D4-DOUT): length 4.1
  Top Layer w0.25: D5.3 37.24,23.17 D4.1
NET-(D5-DOUT): length 4.1
  Top Layer w0.25: D5.1 38.74,18.17 D6.3
NET-(D6-DOUT): length 3.9
  Top Layer w0.25: D7.3 40.24,12.67 D6.1
NET-(D7-DOUT): length 8.1
  Top Layer w0.25: D8.3 44.37,15.04 44.37,11.54 D7.1
NET-(D8-DOUT): length 7.8
  Top Layer w0.25: D8.1 45.37,15.79 45.37,20.04 D9.3
NET-(D10-DOUT): length 3.7
  Top Layer w0.25: D10.1 53.24,12.17 D11.3
NET-(D11-DOUT): length 8.1
  Top Layer w0.25: D11.1 56.62,10.54 56.62,12.42 57.49,13.29 57.49,14.92 D12.3
NET-(D12-DOUT): length 7.9
  Top Layer w0.25: D12.1 58.62,15.54 58.62,18.42 58.99,18.79 58.99,19.92 D13.3
NET-(D13-DOUT): length 7.8
  Top Layer w0.25: D14.3 60.37,25.04 60.37,23.67 60.12,23.42 60.12,20.54 D13.1
NET-(D14-DOUT): length 7.8
  Top Layer w0.25: D14.1 61.62,25.54 61.62,28.42 61.87,28.67 61.87,30.04 D15.3
NET-(D15-DOUT): length 22.1
  Top Layer w0.25: D16.3 69.62,11.17 v1(69.49,11.29) ; v1(64.74,28.04) 64.24,28.54 D15.1
  Bottom Layer w0.25: v1(69.49,11.29) 64.74,16.04 v1(64.74,28.04)
NET-(D17-DOUT): length 8.2
  Top Layer w0.25: D17.1 72.99,16.17 72.99,19.42 D18.3
NET-(D18-DOUT): length 8.2
  Top Layer w0.25: D19.3 73.02,24.39 73.02,21.14 D18.1
NET-(D19-DOUT): length 8.2
  Top Layer w0.25: D19.1 73.62,25.54 73.62,28.79 D20.3
NET-(D20-DOUT): length 4.2
  Top Layer w0.25: D21.3 76.49,29.42 D20.1
NET-(D21-DOUT): length 3.6
  Top Layer w0.25: D22.3 84.99,29.42 D21.1
NET-(D22-DOUT): length 4.8
  Top Layer w0.25: D22.1 88.49,27.42 D23.3
NET-(D24-DOUT): length 17.7
  Top Layer w0.25: v1(94.29,11.09) 94.34,11.04 D25.3 ; D24.1 81.74,17.14 v1(81.79,17.09)
  Bottom Layer w0.25: v1(81.79,17.09) 87.79,11.09 v1(94.29,11.09)
NET-(D25-DOUT): length 8.2
  Top Layer w0.25: D26.3 97.59,14.19 97.59,10.94 D25.1
NET-(D26-DOUT): length 8.2
  Top Layer w0.25: D26.1 97.59,15.94 97.59,19.19 D27.3
NET-(D27-DOUT): length 8.2
  Top Layer w0.25: D28.3 97.59,24.19 97.59,20.94 D27.1
NET-(D28-DOUT): length 8.2
  Top Layer w0.25: D28.1 97.59,25.94 97.59,29.19 D29.3
NET-(J4-VBUS): length 5.3
  Top Layer w0.4: 4.1,25.98 5.67,25.98 JP1.1
NET-(U1-UCAP): length 4.4
  Top Layer w0.25: C6.1 11.04,23.05 U1.6
NET-(U1-XTAL1): length 8.8
  Top Layer w0.25: U1.17 19.95,13.97 Y1.1 21.41,9.3 C3.1
NET-(U1-XTAL2): length 8.8
  Top Layer w0.25: U1.16 19.15,13.96 Y1.2 17.71,9.41 C4.1

## Copper pours and planes (outline as drawn; the poured copper is in the pictures)
+5V on Bottom Layer: 32.24,43.29 32.24,-2.71 106.99,-2.71 106.99,43.29
GND on Top Layer: -3.01,43.29 106.99,43.29 106.99,-2.71 -3.01,-2.71
GND on Bottom Layer: 31.49,43.29 -3.01,43.29 -3.01,-2.71 31.49,-2.71

## Text on the board
Bottom Silkscreen Layer: JLCJLCJLCJLC | rev2.1 | 10.26.24 | github.com/ieee-wpi
Top Silkscreen Layer: TX | RX | 5V | G | ICSP | AR | 3 | 2 | A5 | 1 | A4 | 0 | A3 | 11 | A2 | 4 | A1 | 8 | A0 | 9 | 10 | 13 | .
